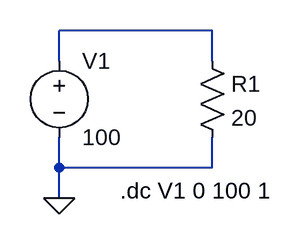
[diagram p0: schematic Lecture1_Ex3.asc]
Lecture1_Ex3.asc, the LTspice schematic file:
Version 4
SHEET 1 880 680
WIRE 256 96 96 96
WIRE 96 128 96 96
WIRE 256 128 256 96
WIRE 96 240 96 208
WIRE 256 240 256 208
WIRE 256 240 96 240
WIRE 96 272 96 240
FLAG 96 272 0
SYMBOL voltage 96 112 R0
SYMATTR InstName V1
SYMATTR Value 100
SYMBOL res 240 112 R0
SYMATTR InstName R1
SYMATTR Value 20
TEXT 160 264 Left 2 !.dc V1 0 100 1

The netlist it stands for:
* Lecture1_Ex3.asc
V1 N001 0 100
R1 N001 0 20
.dc V1 0 100 1
.backanno
.end